# EAGLE design elflet-jig (EAGLE 9.2.2)
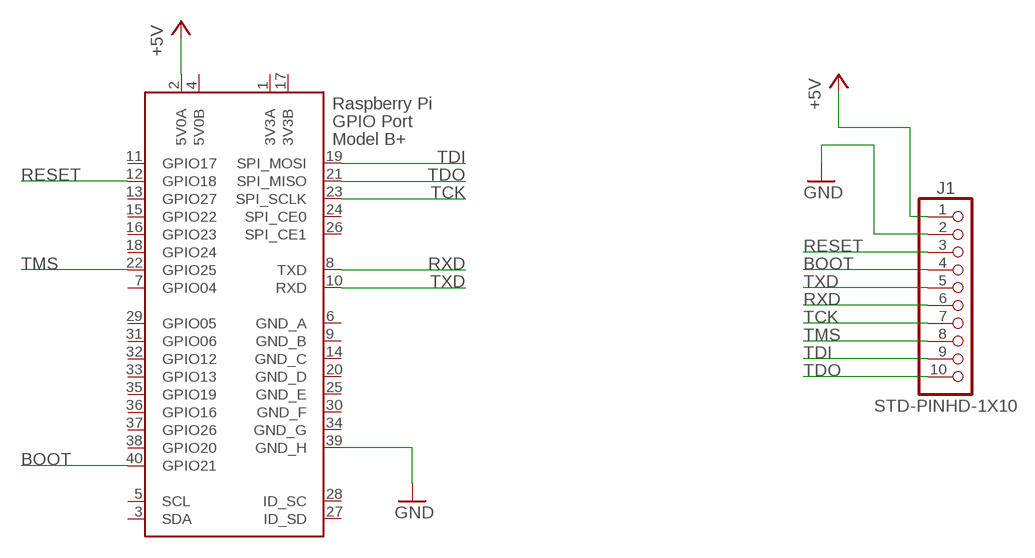
[diagram p0: schematic, sheet 1]

## Parts
J1  STD-PINHD-1X10  [STD-1X10]
X1  RASPI_BOARD_B+#  [RASPI_BOARD_B+HAT_SMALL]

## Nets
+5V [power]: J1.1 X1.2(5V0A)
BOOT: J1.4 X1.40(GPIO21)
GND [gnd]: J1.2 X1.39(GND_H)
RESET: J1.3 X1.12(GPIO18)
RXD: J1.6 X1.8(TXD)
TCK: J1.7 X1.23(SPI_SCLK)
TDI: J1.9 X1.19(SPI_MOSI)
TDO: J1.10 X1.21(SPI_MISO)
TMS: J1.8 X1.22(GPIO25)
TXD: J1.5 X1.10(RXD)
Unconnected: X1.3(SDA) X1.5(SCL) X1.7(GPIO04) X1.11(GPIO17) X1.13(GPIO27) X1.15(GPIO22) X1.16(GPIO23) X1.18(GPIO24) X1.24(SPI_CE0) X1.26(SPI_CE1) X1.27(ID_SD) X1.28(ID_SC) X1.29(GPIO05) X1.31(GPIO06) X1.32(GPIO12) X1.33(GPIO13) X1.35(GPIO19) X1.36(GPIO16) X1.37(GPIO26) X1.38(GPIO20)

## Power pins joined to a net without a drawn wire
3V3A: X1.1(3V3A)
3V3B: X1.17(3V3B)
5V0B: X1.4(5V0B)
GND_A: X1.6(GND_A)
GND_B: X1.9(GND_B)
GND_C: X1.14(GND_C)
GND_D: X1.20(GND_D)
GND_E: X1.25(GND_E)
GND_F: X1.30(GND_F)
GND_G: X1.34(GND_G)

## Library data of the parts
J1 = connector:STD-PINHD-1X10
X1 = raspi:RASPI_BOARD_B+#: Raspberry Pi GPIO connector with markings for the outer dimensions of the Raspberry Pi board model B+ with different sets of drill holes or mounting pads All pins connected

## Net classes
1 power: width 0.61 mm, drill 0.203 mm
2 gnd: width 0.711 mm, drill 0.305 mm

## Board
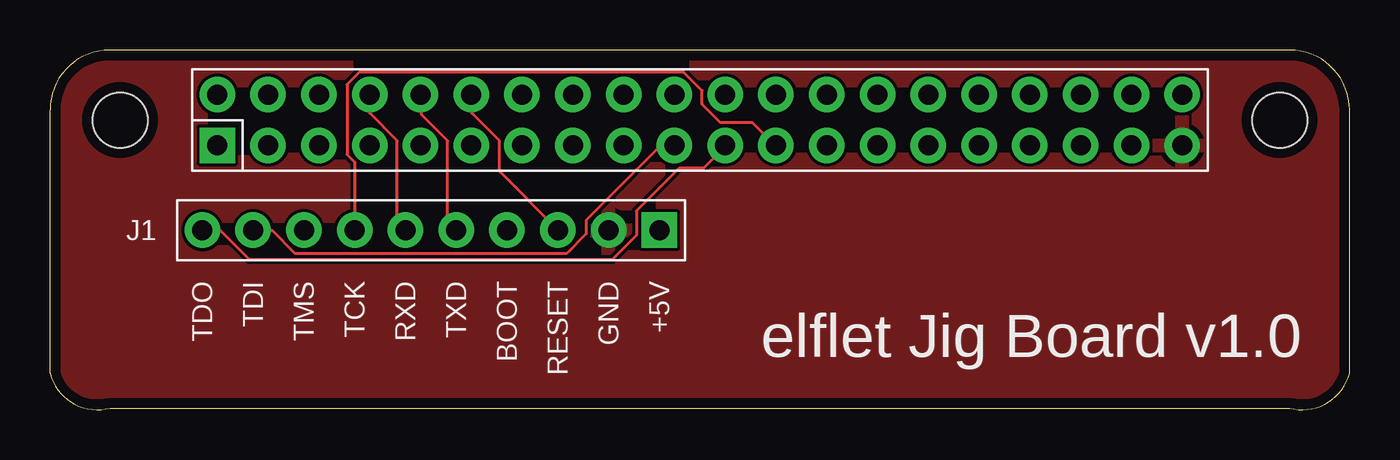
[diagram p1: board, top side]
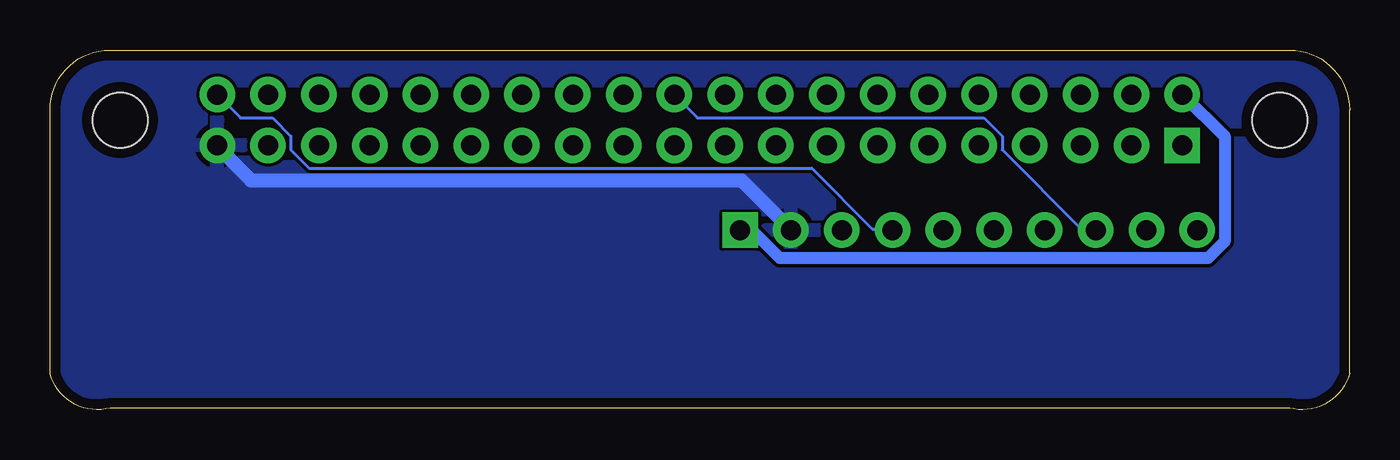
[diagram p2: board, bottom side, seen from below]

Size 65 x 17.98 mm. Coordinates in mm from the lower left corner, seen from the top.
Copper layers (1*16): Top 0.035mm / dielectric 1.6mm / Bottom 0.035mm
Design rules "Elecrow_2-layer_PCB_eagle_rule": minimum track width 6mil, minimum drill 12mil, track to track 6mil, track to pad 6mil, pad to pad 6mil, via to via 8mil, smd to smd 0mil, copper to edge 20mil, drill to drill 10mil, minimum pad ring 6mil, minimum via ring 6mil, stop-mask expansion 0mil, vias tented up to drill 100mil, thermal gap 10mil

### Footprints (pad centres in the part's own frame; a part is rotated, then mirrored left to right if it is on the bottom)
STD-1X10 = drill 1 pad 1.778 square: 1 -11.43,0 | drill 1 pad 1.778: 2 -8.89,0; 3 -6.35,0; 4 -3.81,0; 5 -1.27,0; 6 1.27,0; 7 3.81,0; 8 6.35,0; 9 8.89,0; 10 11.43,0
RASPI_BOARD_B+HAT_SMALL = drill 1 pad 1.778 square: 1 8.37,18.21 | drill 1 pad 1.778: 2 8.37,20.75; 3 10.91,18.21; 4 10.91,20.75; 5 13.45,18.21; 6 13.45,20.75; 7 15.99,18.21; 8 15.99,20.75; 9 18.53,18.21; 10 18.53,20.75; 11 21.07,18.21; 12 21.07,20.75; 13 23.61,18.21; 14 23.61,20.75; 15 26.15,18.21; 16 26.15,20.75; 17 28.69,18.21; 18 28.69,20.75; 19 31.23,18.21; 20 31.23,20.75; 21 33.77,18.21; 22 33.77,20.75; 23 36.31,18.21; 24 36.31,20.75; 25 38.85,18.21; 26 38.85,20.75; 27 41.39,18.21; 28 41.39,20.75; 29 43.93,18.21; 30 43.93,20.75; 31 46.47,18.21; 32 46.47,20.75; 33 49.01,18.21; 34 49.01,20.75; 35 51.55,18.21; 36 51.55,20.75; 37 54.09,18.21; 38 54.09,20.75; 39 56.63,18.21; 40 56.63,20.75 | hole 2.75: 3.5,19.48; 61.5,19.48

### Placement (x,y rotation side)
J1  19.05,8.97 180 top
X1  0,-5 0 top

### Tracks (layer width: path | path; a pad name or v marks a point on that pad's centre or on a via)
+5V
  Bottom 0.61: J1.1 30.48,8.95 29.87,8.95 28.5,7.58 7.09,7.58 6.25,8.41 6.25,13.67 8.31,15.73 X1.2
BOOT
  Bottom 0.152: J1.4 22.86,9.02 23.85,9.02 26.9,12.07 52.05,12.07 52.96,12.99 52.96,13.67 53.87,14.59 55.47,14.59 56.62,15.73 X1.40
GND
  Bottom 0.711: 56.62,13.14 54.94,11.46 30.4,11.46 27.96,9.02 J1.2
  pour Top: -0.25,18.75 65.79,18.75 65.79,7.83 65.79,-0.93 15.11,-0.93 -0.38,-0.93 -0.38,18.75
  pour Bottom: -1.27,20.4 67.31,20.4 67.31,5.16 67.31,-2.46 20.32,-2.46 -1.27,-2.46
RESET
  Top 0.152: X1.12 21.11,15.73 21.11,14.82 22.48,13.44 22.48,11.92 25.38,9.02 J1.3
RXD
  Top 0.152: X1.8 16,15.73 16,14.82 17.37,13.44 17.37,9.41 17.75,9.02 J1.6
TCK
  Top 0.152: J1.7 15.24,12.38 14.86,12.76 14.86,16.26 15.47,16.87 31.7,16.87 32.61,15.96 32.61,15.27 33.53,14.36 35.13,14.36 36.27,13.22 X1.23
TDI
  Top 0.152: J1.9 10.21,8.95 11.12,8.95 12.27,7.81 25.83,7.81 26.82,8.8 26.82,9.48 30.48,13.14 31.17,13.14 X1.19
TDO
  Top 0.152: J1.10 7.62,8.95 8.53,8.95 9.98,7.5 28.12,7.5 29.34,8.72 29.34,9.94 31.47,12.07 32.69,12.07 33.76,13.14 X1.21
TMS
  Bottom 0.152: J1.8 12.72,9.02 13.41,9.02 17.37,12.99 17.37,13.67 18.29,14.59 32.61,14.59 33.76,15.73 X1.22
TXD
  Top 0.152: J1.5 19.89,9.41 19.89,13.44 18.59,14.74 18.59,15.73 X1.10

### Text on the board
tPlace: TDO | TDI | TMS | TCK | RXD | TXD | BOOT | RESET | GND | +5V | elflet Jig Board v1.0